# EAGLE design segment (EAGLE 6.1)
DOC_ID: CLK-SCH-05; DOC_PART_NO: CLK-PC-05; DOC_REV: A; DOC_TITLE: Display (Model B) - Segment PCB; PROJECT_NAME: Alarm Clock
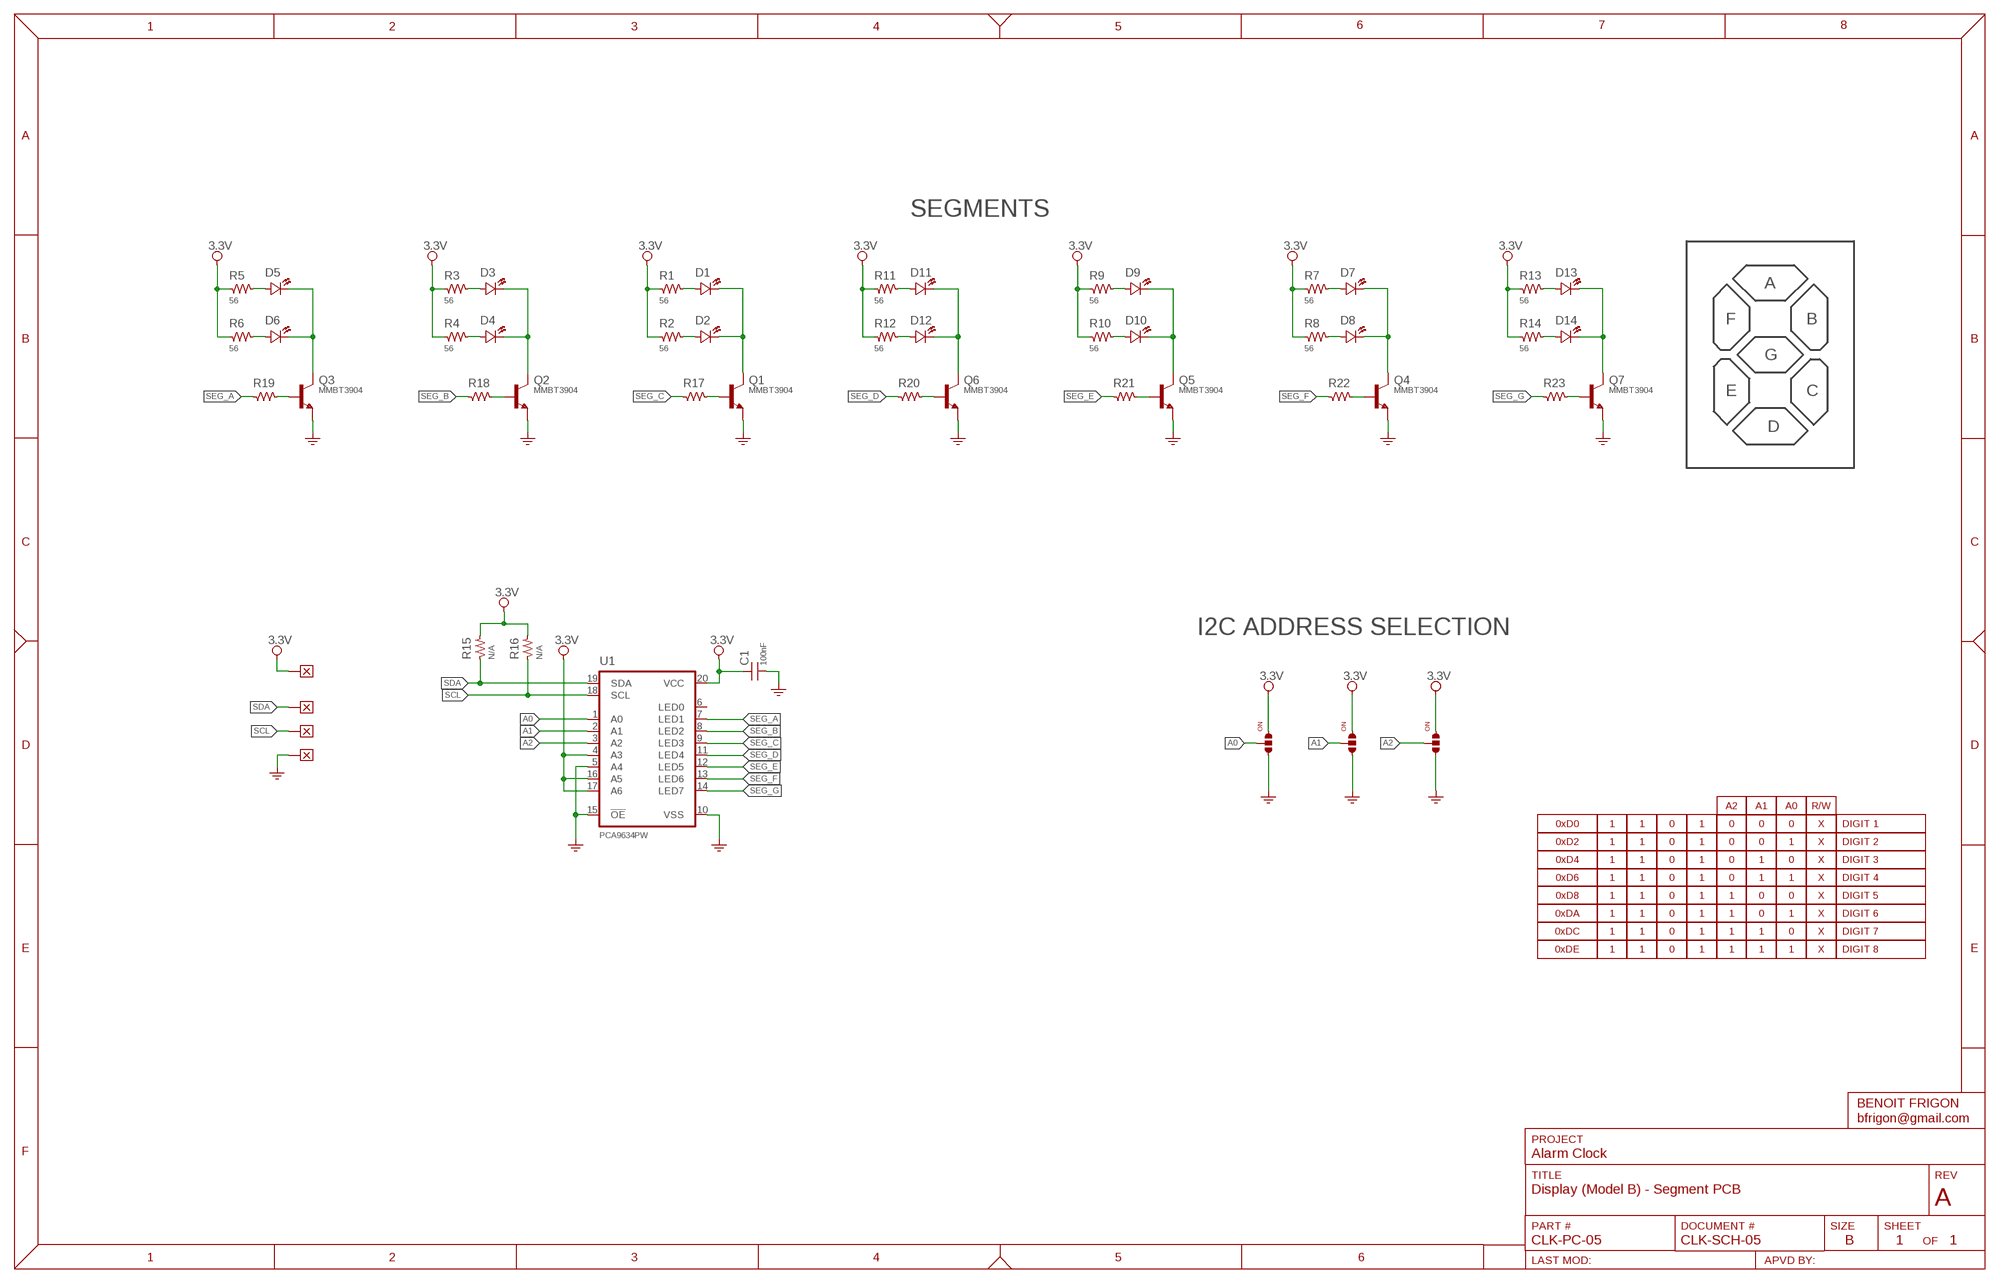
[diagram p0: schematic, sheet 1]

## Parts
C1  100nF  CAP-0603  [SMD_0603]
D1  Red  LED-0805  [CHIPLED_0805]
D2  Red  LED-0805  [CHIPLED_0805]
D3  Red  LED-0805  [CHIPLED_0805]
D4  Red  LED-0805  [CHIPLED_0805]
D5  Red  LED-0805  [CHIPLED_0805]
D6  Red  LED-0805  [CHIPLED_0805]
D7  Red  LED-0805  [CHIPLED_0805]
D8  Red  LED-0805  [CHIPLED_0805]
D9  Red  LED-0805  [CHIPLED_0805]
D10  Red  LED-0805  [CHIPLED_0805]
D11  Red  LED-0805  [CHIPLED_0805]
D12  Red  LED-0805  [CHIPLED_0805]
D13  Red  LED-0805  [CHIPLED_0805]
D14  Red  LED-0805  [CHIPLED_0805]
J1  SOLDER_JUMPER_3  [SOLDER_JUMPER_3]
J2  SOLDER_JUMPER_3  [SOLDER_JUMPER_3]
J3  SOLDER_JUMPER_3  [SOLDER_JUMPER_3]
Q1  MMBT3904  [SOT23]
Q2  MMBT3904  [SOT23]
Q3  MMBT3904  [SOT23]
Q4  MMBT3904  [SOT23]
Q5  MMBT3904  [SOT23]
Q6  MMBT3904  [SOT23]
Q7  MMBT3904  [SOT23]
R1  56  RES-0603  [SMD_0603]
R2  56  RES-0603  [SMD_0603]
R3  56  RES-0603  [SMD_0603]
R4  56  RES-0603  [SMD_0603]
R5  56  RES-0603  [SMD_0603]
R6  56  RES-0603  [SMD_0603]
R7  56  RES-0603  [SMD_0603]
R8  56  RES-0603  [SMD_0603]
R9  56  RES-0603  [SMD_0603]
R10  56  RES-0603  [SMD_0603]
R11  56  RES-0603  [SMD_0603]
R12  56  RES-0603  [SMD_0603]
R13  56  RES-0603  [SMD_0603]
R14  56  RES-0603  [SMD_0603]
R15  N/A  RES-0603  [SMD_0603]
R16  N/A  RES-0603  [SMD_0603]
R17  RES-0603  [SMD_0603]
R18  RES-0603  [SMD_0603]
R19  RES-0603  [SMD_0603]
R20  RES-0603  [SMD_0603]
R21  RES-0603  [SMD_0603]
R22  RES-0603  [SMD_0603]
R23  RES-0603  [SMD_0603]
U1  PCA9634PW  [TSSOP20]
W1  WIRE  [WIRE_SMT]
W2  WIRE  [WIRE_SMT]
W3  WIRE  [WIRE_SMT]
W4  WIRE  [WIRE_SMT]

## Nets
3.3V: C1.1 J1.1 J2.1 J3.1 R1.1 R2.1 R3.1 R4.1 R5.1 R6.1 R7.1 R8.1 R9.1 R10.1 R11.1 R12.1 R13.1 R14.1 R15.2 R16.2 U1.4(A3) U1.16(A5) U1.17(A6) U1.20(VCC) W1.1
A0: J2.2 U1.1(A0)
A1: J1.2 U1.2(A1)
A2: J3.2 U1.3(A2)
GND: C1.2 J1.3 J2.3 J3.3 Q1.2(E) Q2.2(E) Q3.2(E) Q4.2(E) Q5.2(E) Q6.2(E) Q7.2(E) U1.5(A4) U1.10(VSS) U1.15(!OE) W4.1
N$1: Q1.1(B) R17.2
N$2: D7.K D8.K Q4.3(C)
N$3: D13.K D14.K Q7.3(C)
N$4: D1.K D2.K Q1.3(C)
N$5: D3.K D4.K Q2.3(C)
N$6: D5.K D6.K Q3.3(C)
N$7: D3.A R3.2
N$8: D4.A R4.2
N$9: D14.A R14.2
N$10: D13.A R13.2
N$11: D2.A R2.2
N$12: D1.A R1.2
N$13: D5.A R5.2
N$14: D6.A R6.2
N$15: D11.A R11.2
N$16: D9.K D10.K Q5.3(C)
N$17: D11.K D12.K Q6.3(C)
N$18: D12.A R12.2
N$19: D10.A R10.2
N$20: D9.A R9.2
N$21: D7.A R7.2
N$22: D8.A R8.2
N$23: Q2.1(B) R18.2
N$24: Q3.1(B) R19.2
N$25: Q6.1(B) R20.2
N$26: Q5.1(B) R21.2
N$27: Q4.1(B) R22.2
N$28: Q7.1(B) R23.2
SCL: R16.1 U1.18(SCL) W3.1
SDA: R15.1 U1.19(SDA) W2.1
SEG_A: R19.1 U1.7(LED1)
SEG_B: R18.1 U1.8(LED2)
SEG_C: R17.1 U1.9(LED3)
SEG_D: R20.1 U1.11(LED4)
SEG_E: R21.1 U1.12(LED5)
SEG_F: R22.1 U1.13(LED6)
SEG_G: R23.1 U1.14(LED7)
Unconnected: U1.6(LED0)

## Notes on the sheet
- SEGMENTS
- A
- F | B
- G
- E | C
- D
- I2C ADDRESS SELECTION

## Library data of the parts
C1 = Passive:CAP: Capacitor; DESCRIPTION: {DESCRIPTION} - SMT 0603 - {value}; PACKAGE: SMT 0603
D1-D14 = Optoelectronic:LED: Led; COLOR: Red; DESCRIPTION: {DESCRIPTION} Chip 0805 - {ATTR:COLOR}; MFG: Kingbright; PACKAGE: SMT 0805; SKU: APT2012SECK/J3-PRV; VALUE: {ATTR:COLOR}
J1-J3 = Misc:SOLDER_JUMPER_3; BOM: False; SKU: -
Q1-Q7 = Transistor:MMBT3904: NPN Transistor
R1-R23 = Passive:RES: Resistor; DESCRIPTION: {DESCRIPTION} - SMT 0603 - {VALUE}; PACKAGE: SMT 0603
U1 = IC:PCA9634: 8-bit fm+ i2c-bus LED driver The PCA9634 is an I2C-bus controlled 8-bit LED driver optimized for Red/Green/Blue/Amber (RGBA) color mixing applications. Each LED output has its own 8-bit resolution (256 steps) fixed frequency Individual PWM controller that operates at 97 kHz with a duty cycle that is adjustable from 0 % to 99.6 % to allow the LED to be set to a specific brightness value. An additional 8-bit resolution (256 steps) Group PWM controller has both a fixed frequency of 190 Hz and an adjustable frequency between 24 Hz to once every 10.73 seconds with a duty cycle that is adjustable from 0 % to 99.6 % that is used to either dim or blink all LEDs with the same value. Features 8 LED drivers. Each output programmable at: Off On Programmable LED brightness Programmable group dimming/blinking mixed with individual LED brightness 1 MHz Fast-mode Plus compatible I2C-bus interface with 30 mA high drive capability on SDA output for driving high capacitive buses 256-step (8-bit) linear programmable brightness per LED output varying from fully off (default) to maximum brightness using a 97 kHz PWM signal 256-step group brightness control allows general dimming (using a 190 Hz PWM signal) from fully off to maximum brightness (default) 256-step group blinking with frequency programmable from 24 Hz to 10.73 s and duty cycle from 0 % to 99.6 % Eight totem-pole outputs (sink 25 mA and source 10 mA at 5 V) with software programmable open-drain LED outputs selection (default at totem-pole). No input function. Output state change programmable on the Acknowledge or the STOP Command to update outputs byte-by-byte or all at the same time (default to ‘Change on STOP’). Active LOW Output Enable (OE) input pin. LED outputs programmable to 1, 0 or ‘high-impedance’ (default at power-up) when OE is HIGH, thus allowing hardware blinking and dimming of the LEDs. 7 hardware address pins allow 126 devices to be connected to the same I2C-bus 4 software programmable I2C-bus addresses (one LED Group Call address and three LED Sub Call addresses) allow groups of devices to be addressed at the same time in any combination (for example, one register used for ‘All Call’ so that all the PCA9634s on the I2C-bus can be addressed at the same time and the second register used for three different addresses so that 1⁄3 of all devices on the bus can be addressed at the same time in a group). Software enable and disable for I2C-bus address. Software Reset feature (SWRST Call) allows the device to be reset through the I2C-bus 25 MHz internal oscillator requires no external components Internal power-on reset Noise filter on SDA/SCL inputs Edge rate control on outputs No glitch on power-up Supports hot insertion Low standby current Operating power supply voltage range of 2.3 V to 5.5 V 5.5 V tolerant inputs; MFG: NXP Semiconductors
W1-W4 = Misc:WIRE; BOM: False

## Board
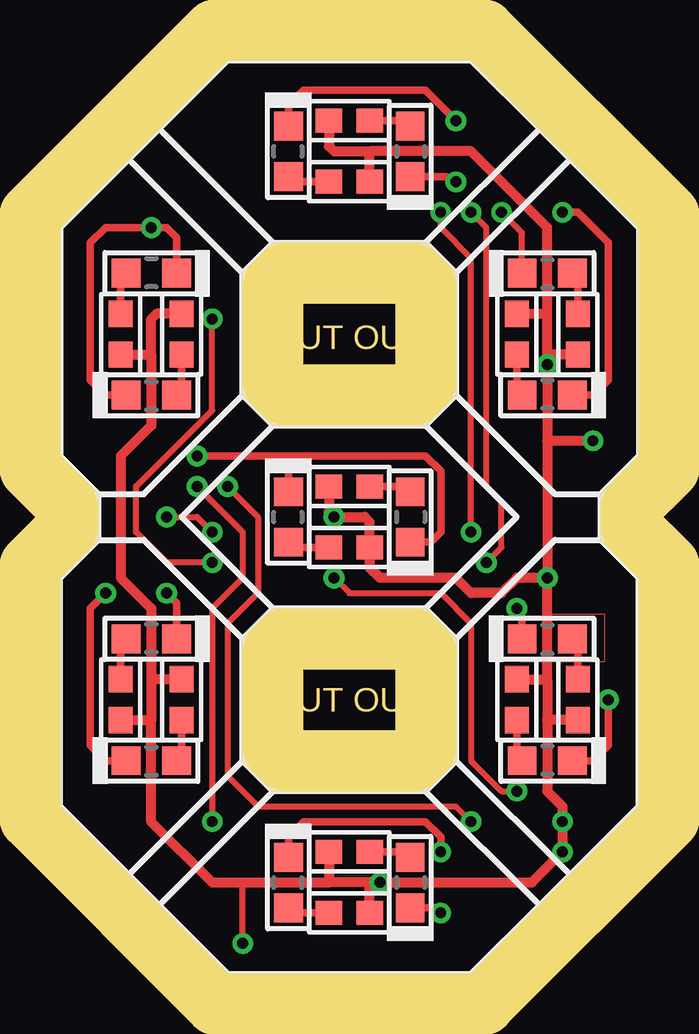
[diagram p1: board, top side]
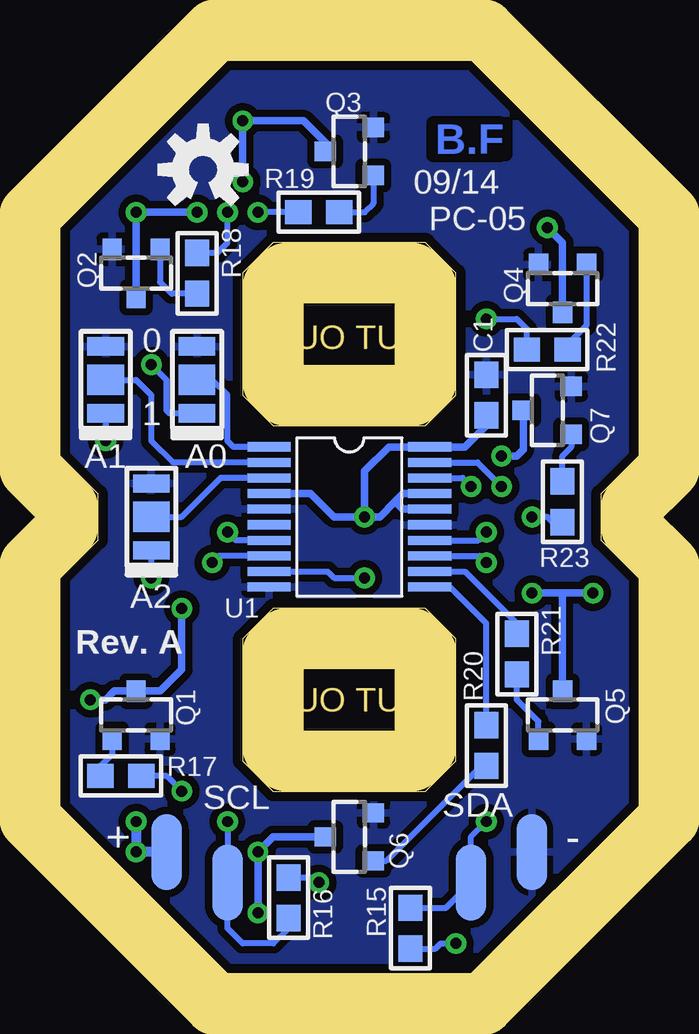
[diagram p2: board, bottom side, seen from below]

Size 24.13 x 38.1 mm. Coordinates in mm from the lower left corner, seen from the top.
Outline: 6.99,0 17.14,0 24.13,6.99 24.13,16.51 22.54,18.1 22.54,20 24.13,21.59 24.13,31.11 17.14,38.1 6.99,38.09 6.98,38.09 0,31.11 0,21.59 1.59,20 1.59,18.1 0,16.51 0,6.99 6.99,0
Outline: 8.89,7.62 7.62,8.89 7.62,13.97 8.89,15.24 15.24,15.24 16.51,13.97 16.51,8.89 15.24,7.62 8.89,7.62
Outline: 15.24,22.86 8.89,22.86 7.62,24.13 7.62,29.21 8.89,30.48 15.24,30.48 16.51,29.21 16.51,24.13 15.24,22.86
Copper layers (1*16): Top 0.035mm / dielectric 1.5mm / Bottom 0.035mm
Design rules: minimum track width 8mil, minimum drill 16mil, track to track 8mil, track to pad 8mil, pad to pad 8mil, via to via 8mil, smd to smd 8mil, copper to edge 16mil, drill to drill 8mil, minimum pad ring 10mil, minimum via ring 8mil, stop-mask expansion 4mil, vias tented up to drill 24mil, thermal gap 10mil
Milling: 33 lines

### Footprints (pad centres in the part's own frame; a part is rotated, then mirrored left to right if it is on the bottom)
SMD_0603 = smd 1.1 x 1: 1 -0.85,0; 2 0.85,0
CHIPLED_0805 = smd 1.2 x 1.2: A 0,-1.05; K 0,1.05
SOLDER_JUMPER_3 = smd 0.762 x 1.524: 1 -1.397,0; 3 1.397,0 | smd 1.27 x 1.524: 2 0,0
SOT23 = smd 0.8 x 0.9: 1 -1,-1; 2 1,-1; 3 0,1
TSSOP20 = smd 0.38 x 1.8: 1 -2.925,-3.35; 2 -2.275,-3.35; 3 -1.625,-3.35; 4 -0.975,-3.35; 5 -0.325,-3.35; 6 0.325,-3.35; 7 0.975,-3.35; 8 1.625,-3.35; 9 2.275,-3.35; 10 2.925,-3.35; 11 2.925,3.35; 12 2.275,3.35; 13 1.625,3.35; 14 0.975,3.35; 15 0.325,3.35; 16 -0.325,3.35; 17 -0.975,3.35; 18 -1.625,3.35; 19 -2.275,3.35; 20 -2.925,3.35
WIRE_SMT = smd 3.175 x 1.27: 1 0,0

### Placement (x,y rotation side)
C1  6.35,24.13 90 bottom
D1  20.32,8.89 270 top
D2  20.32,13.97 90 top
D3  20.32,24.13 270 top
D4  20.32,29.21 90 top
D5  14.61,34.29 180 top
D6  9.53,34.29 0 top
D7  3.81,29.21 270 top
D8  3.81,24.13 90 top
D9  3.81,13.97 270 top
D10  3.81,8.89 90 top
D11  9.53,3.81 0 top
D12  14.61,3.81 180 top
D13  9.53,19.05 0 top
D14  14.61,19.05 180 top
J1  22.23,24.77 90 bottom
J2  18.41,24.77 90 bottom
J3  20.32,19.05 90 bottom
Q1  20.95,10.79 0 bottom
Q2  20.95,29.21 180 bottom
Q3  12.06,34.29 90 bottom
Q4  3.17,28.57 180 bottom
Q5  3.17,10.79 0 bottom
Q6  12.06,5.71 90 bottom
Q7  3.81,23.5 90 bottom
R1  19.05,11.43 270 top
R2  21.59,11.43 90 top
R3  19.05,26.67 270 top
R4  21.59,26.67 90 top
R5  12.06,35.56 0 top
R6  12.06,33.02 180 top
R7  2.54,26.67 90 top
R8  5.08,26.67 270 top
R9  2.54,11.43 90 top
R10  5.08,11.43 270 top
R11  12.06,2.54 180 top
R12  12.06,5.08 0 top
R13  12.06,17.78 180 top
R14  12.06,20.32 0 top
R15  9.53,1.91 270 bottom
R16  14.61,3.17 90 bottom
R17  21.59,8.26 180 bottom
R18  18.41,29.21 270 bottom
R19  13.34,31.75 0 bottom
R20  6.35,9.53 270 bottom
R21  5.08,13.34 270 bottom
R22  3.81,26.04 0 bottom
R23  3.17,19.68 90 bottom
U1  12.06,19.05 270 bottom
U$1  [OPENHW_LOGO_150]  18.16,33.53 0 bottom
U$2  [INFO_AUTHOR]  7.05,34.8 0 bottom
W1  19.68,5.08 90 bottom
W2  6.99,3.81 90 bottom
W3  17.14,3.81 270 bottom
W4  4.45,5.08 270 bottom

### Tracks (layer width: path | path; a pad name or v marks a point on that pad's centre or on a via)
3.3V  (via drill 0.46)
  Top 0.254: v7.62,1.27 7.62,3.81
  Top 0.406: 11.21,3.81 7.62,3.81 6.35,3.81 3.81,6.35 3.81,10.58 | v13.34,3.81 19.68,3.81 v20.95,5.08 v20.95,6.35 20.95,6.99 20.32,7.62 20.32,10.58 | R12.1 11.21,3.81 | R11.1 12.91,3.81 v13.34,3.81 | v13.34,3.81 11.21,3.81 | R2.1 20.32,10.58 | 20.32,12.28 v20.32,16.51 | 20.32,27.52 20.32,31.11 17.14,34.29 12.91,34.29 | R3.1 20.32,27.52 | R4.1 20.32,25.82 | 20.32,25.82 20.32,27.52 | R9.1 3.81,10.58 | R1.1 20.32,12.28 | 20.32,12.28 20.32,10.58 | R7.1 3.81,25.82 | R6.1 12.91,34.29 | 12.91,34.29 11.43,34.29 11.21,34.51 R5.1 | R14.1 11.21,19.27 v11.43,19.05 12.7,19.05 12.91,18.84 R13.1 12.91,16.93 13.34,16.51 16.51,16.51 17.14,15.88 18.41,15.88 19.05,16.51 v20.32,16.51 | 3.81,25.82 3.81,22.86 2.54,21.59 2.54,16.51 3.81,15.24 3.81,12.28 | 20.32,25.82 v20.32,25.4 20.32,22.23 | 20.32,22.23 v20.32,16.51 | R10.1 3.81,12.28 | 3.81,12.28 3.81,10.58 | 3.81,25.82 3.81,27.3 4.03,27.52 R8.1 | v22.23,22.23 20.32,22.23
  Bottom 0.254: R16.2 13.55,4.03 v13.34,3.81 | R15.2 8.47,1.05 8.26,1.27 v7.62,1.27 | J1.1 v22.23,22.23 | J2.1 19.56,23.37 19.68,23.5 19.68,24.77 v20.32,25.4 | J3.1 v20.32,16.51
  Bottom 0.305: v11.43,19.05 10.79,19.05 10.16,19.68 | U1.17 9.82,20.02 10.16,19.68 | U1.16 9.85,19.38 10.16,19.68 | v11.43,19.05 11.43,20.95 10.41,21.98 U1.20 7.24,21.98 6.35,22.86 C1.1 | U1.4 13.68,20.02 12.7,19.05 v11.43,19.05
  Bottom 0.406: v20.95,6.35 v20.95,5.08 W1.1 19.68,5.71
A0
  Bottom 0.254: U1.1 16.89,21.98 17.14,22.23 17.14,24.13 17.78,24.77 J2.2
A1
  Bottom 0.254: J1.2 20.95,24.77 20.32,24.13 20.32,22.23 19.42,21.32 U1.2
A2
  Bottom 0.254: U1.3 17.43,20.68 19.05,19.05 J3.2
GND
  pour Bottom (isolate 0.305, rank 3): 6.99,0 0,6.99 0,31.11 6.99,38.1 17.14,38.1 24.13,31.11 24.13,6.99 17.14,0
N$1
  Bottom 0.254: R17.2 22.44,8.68 21.95,9.16 Q1.1
N$2  (via drill 0.46)
  Top 0.305: D8.K 1.91,24.13 1.27,24.77 1.27,30.48 1.91,31.11 v3.81,31.11 4.45,31.11 4.86,30.7 D7.K
  Bottom 0.305: Q4.3 3.17,30.48 v3.81,31.11
N$3  (via drill 0.46)
  Top 0.305: 9.53,21.59 15.24,21.59 15.88,20.95 15.88,18.41 15.46,18 D14.K | 9.53,21.59 9.53,20.32 | 9.53,21.59 v5.71,21.59
  Top 0.406: D13.K 9.53,20.32
  Bottom 0.305: v5.71,21.59 5.08,21.59 4.81,21.86 Q7.3
N$4  (via drill 0.46)
  Top 0.305: D1.K 22.23,8.89 22.86,9.53 v22.86,11.43 | D2.K 19.27,15.02 v19.05,15.24
  Bottom 0.305: v22.86,11.43 22.23,11.43 21.86,11.79 Q1.3 19.95,11.79 19.05,12.7 v19.05,15.24
N$5  (via drill 0.46)
  Top 0.254: D4.K 19.27,30.89 v18.41,31.75
  Top 0.305: D3.K 22.23,24.13 22.86,24.77 22.86,30.48 21.59,31.75 v20.95,31.75
  Bottom 0.305: v18.41,31.75 v20.95,31.75 Q2.3
N$6  (via drill 0.46)
  Top 0.305: D6.K 9.53,36.2 10.16,36.83 15.24,36.83 v16.51,35.56 | D5.K 16.09,33.24 16.32,33.02 v16.51,33.02
  Bottom 0.305: v16.51,33.02 v16.51,35.56 13.97,35.56 13.06,34.66 Q3.3
N$7
  Top 0.305: D3.A 19.05,24.13 R3.2
N$8
  Top 0.305: D4.A 21.59,29.21 R4.2
N$9
  Top 0.305: R14.2 14.61,20.32 D14.A
N$10
  Top 0.305: R13.2 9.53,17.78 D13.A
N$11
  Top 0.305: D2.A 21.59,13.97 R2.2
N$12
  Top 0.305: D1.A 19.05,8.89 R1.2
N$13
  Top 0.305: R5.2 14.61,35.56 D5.A
N$14
  Top 0.305: R6.2 9.53,33.02 D6.A
N$15
  Top 0.305: R11.2 9.53,2.54 D11.A
N$16  (via drill 0.46)
  Top 0.305: v1.91,15.88 1.27,15.24 1.27,9.53 1.91,8.89 D10.K 2.54,8.89 | D9.K 4.86,15.46 v4.45,15.88
  Bottom 0.305: v1.91,15.88 3.17,15.88 | 3.17,15.88 v4.45,15.88 | Q5.3 3.17,15.88
N$17  (via drill 0.46)
  Top 0.305: D11.K 9.53,5.71 10.16,6.35 15.24,6.35 15.88,5.71 v15.88,5.08 | D12.K 15.65,2.76 v15.88,2.54
  Bottom 0.305: v15.88,2.54 v15.88,5.08 15.24,5.71 Q6.3
N$18
  Top 0.305: R12.2 14.61,5.08 D12.A
N$19
  Top 0.305: D10.A 5.08,8.89 R10.2
N$20
  Top 0.305: D9.A 2.54,13.97 R9.2
N$21
  Top 0.305: D7.A 2.54,29.21 R7.2
N$22
  Top 0.305: D8.A 5.08,24.13 R8.2
N$23
  Bottom 0.254: R18.2 19.47,28.36 19.95,28.84 Q2.1
N$24
  Bottom 0.254: R19.2 11.43,31.75 11.06,32.12 Q3.1
N$25
  Bottom 0.254: 11.06,4.87 Q6.1 10.53,4.71 6.35,8.89 R20.2
N$26
  Bottom 0.254: Q5.1 4.17,10.53 5.08,11.43 R21.2
N$27
  Bottom 0.254: Q4.1 2.17,27.04 2.96,26.25 R22.2
N$28
  Bottom 0.254: Q7.1 2.81,21.95 3.17,21.59 R23.2
N$29
  Top 0: 20.2,15 22.7,15 22.7,13 19.2,13
SCL  (via drill 0.46)
  Top 0.254: v6.99,20.32 8.26,19.05 8.26,15.88 6.99,14.61 6.99,8.26 8.26,6.99 16.51,6.99 v17.14,6.35
  Bottom 0.254: U1.18 7.34,20.68 v6.99,20.32 | v17.14,6.35 W3.1 17.14,1.91 16.51,1.27 15.24,1.27 14.61,1.91 R16.1
SDA  (via drill 0.46)
  Top 0.254: v5.71,20.32 7.62,18.41 7.62,16.51 6.35,15.24 v6.35,6.35
  Bottom 0.254: U1.19 6.72,21.32 v5.71,20.32 | v6.35,6.35 6.99,5.71 W2.1 8.04,2.75 R15.1
SEG_A  (via drill 0.46)
  Top 0.254: v17.14,18.41 17.14,29.84 15.88,31.11 v15.88,31.75
  Bottom 0.254: U1.7 16.8,18.07 v17.14,18.41 | R19.1 v15.88,31.75
SEG_B  (via drill 0.46)
  Top 0.254: v17.78,17.14 18.41,17.78 18.41,19.68 17.78,20.32 17.78,31.11 v17.14,31.75
  Bottom 0.254: U1.8 17.5,17.43 v17.78,17.14 | R18.1 17.57,30.06 17.14,30.48 v17.14,31.75
SEG_C  (via drill 0.46)
  Top 0.254: v11.43,16.51 12.06,15.88 15.88,15.88 17.14,14.61 17.14,8.89 18.41,7.62 v19.05,7.62
  Bottom 0.254: U1.9 12.96,16.77 12.7,16.51 v11.43,16.51 | v19.05,7.62 19.68,8.26 R17.1
SEG_D
  Bottom 0.254: U1.11 7.87,16.12 6.35,14.61 R20.1
SEG_E
  Bottom 0.254: U1.12 7.25,16.77 5.08,14.61 R21.1
SEG_F  (via drill 0.46)
  Top 0.254: v6.35,27.3 6.35,23.5 3.17,20.32 3.17,18.41 4.45,17.14 v6.35,17.14
  Bottom 0.254: U1.13 6.63,17.43 v6.35,17.14 | v6.35,27.3 5.08,27.3 4.66,26.89 R22.1
SEG_G  (via drill 0.46)
  Top 0.254: v4.45,19.05 5.71,19.05 v6.35,18.41
  Bottom 0.254: U1.14 6.69,18.07 v6.35,18.41 | R23.1 3.6,18.84 3.81,19.05 v4.45,19.05

### Text on the board
Dimension: CUT OUT | CUT OUT
bPlace: 0 | 1 | A0 | A1 | A2 | Rev. A | SDA | SCL | - | +
_bsilk: Q3 | 09/14 | R19 | PC-05 | R18 | Q2 | Q4 | R22 | C1 | 0 | Q7 | 1 | A0 | A1 | R23 | R21 | U1 | A2 | Rev. A | Q5 | Q1 | R20 | R17 | SDA | SCL | Q6 | - | + | R16 | R15